# Altium schematic sheet Analog3.schdoc: 916 MHz Transmitter
size B; DocumentNumber: Page Create Date; Revision: 3; SheetNumber: 3; SheetTotal: 3
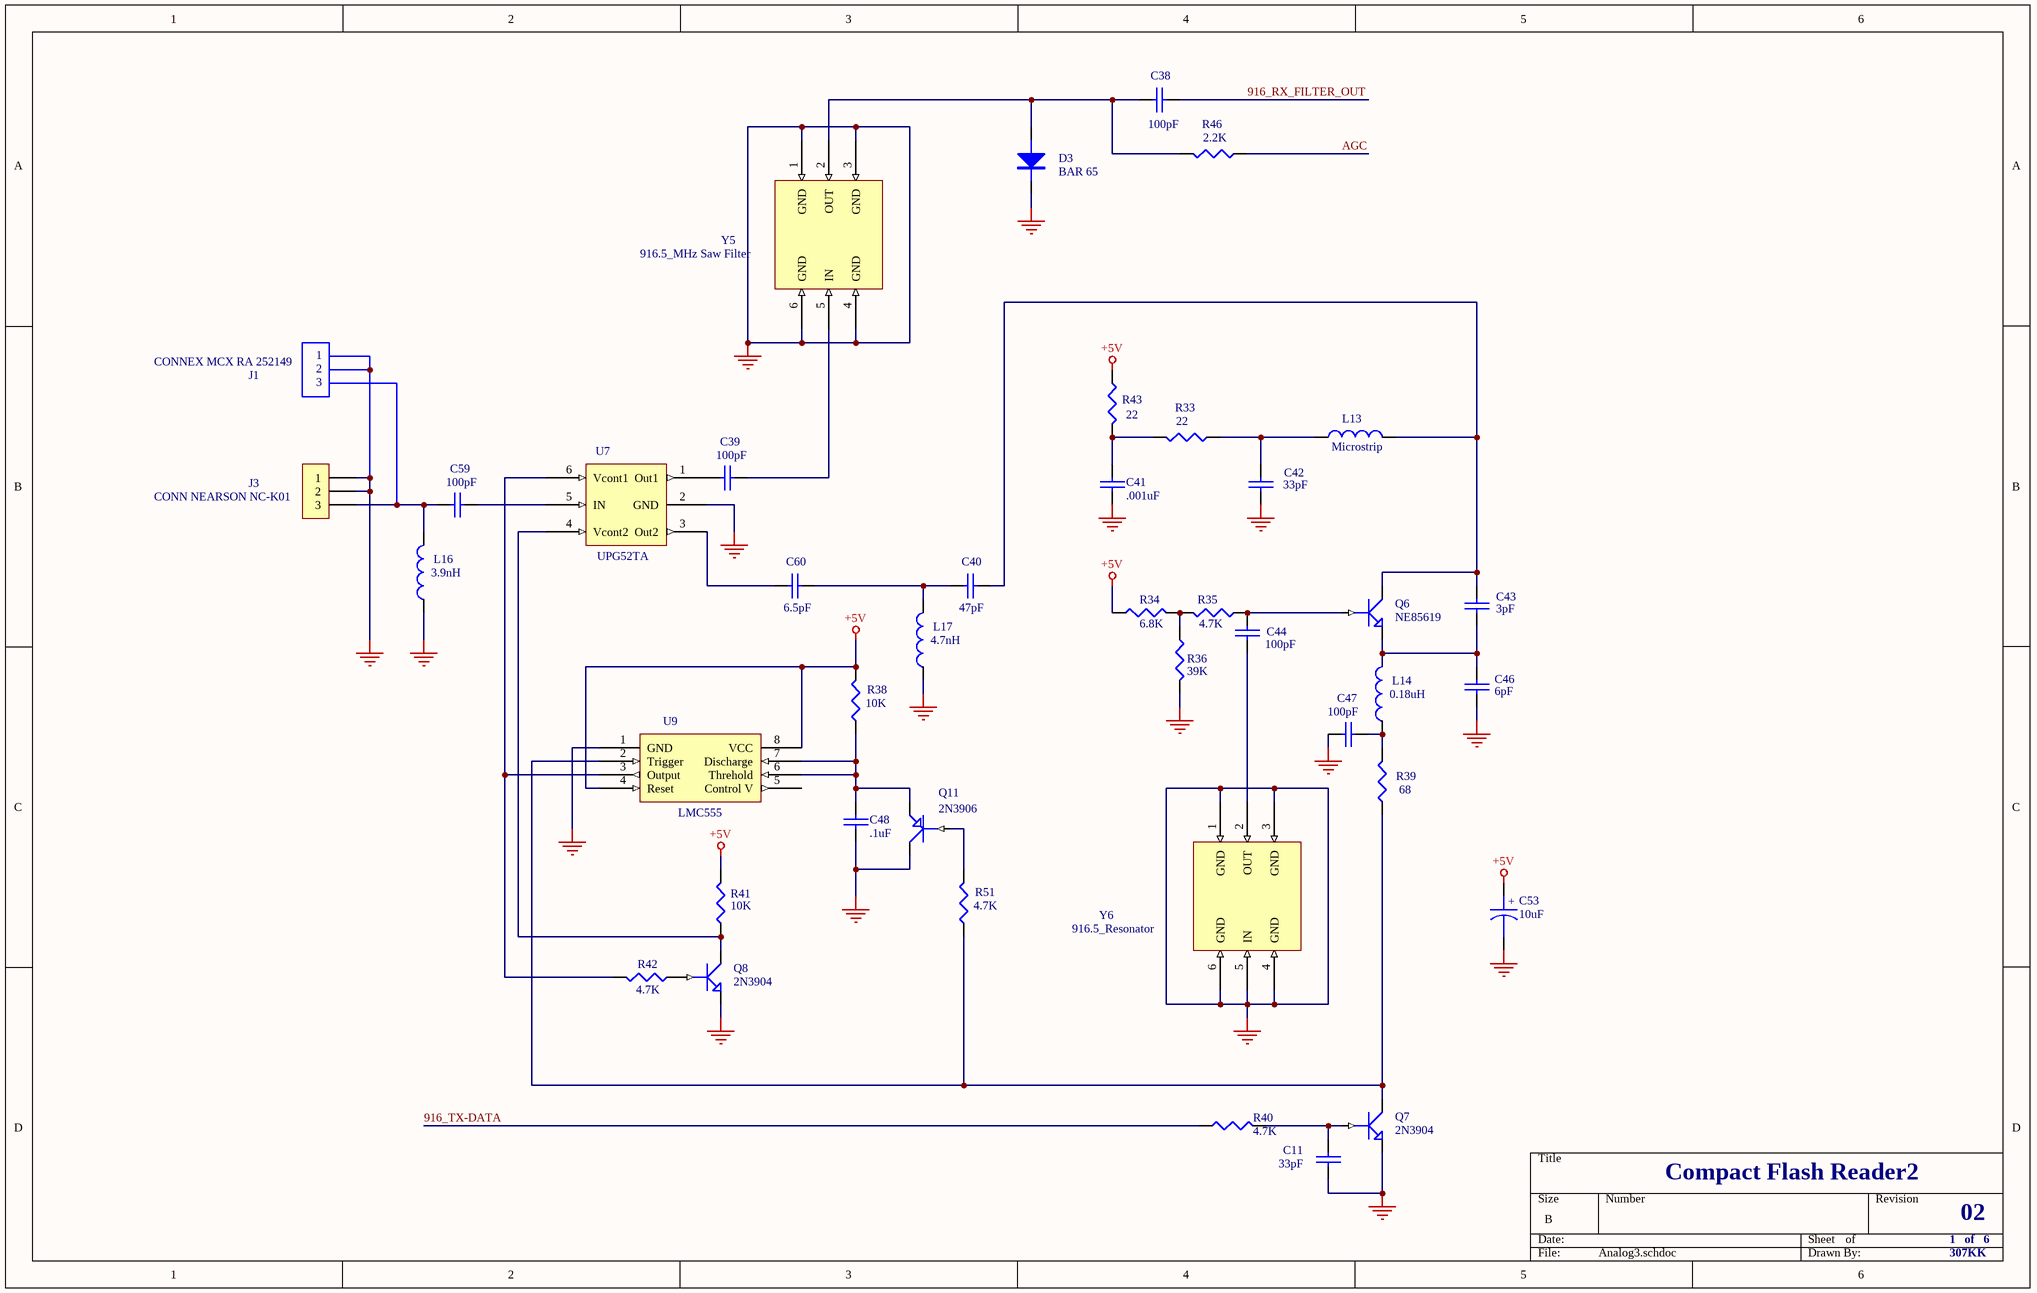
[diagram p0: Analog3.schdoc]

## Parts
C11  33pF  [0603]
C38  100pF  [0603]
C39  100pF  [0603]
C40  47pF  [0603]
C41  .001uF  [0603]
C42  33pF  [0603]
C43  3pF  [0603]
C44  100pF  [0603]
C46  6pF  [0603]
C47  100pF  [0603]
C48  .1uF  [0603]
C53  10uF  [CAP A CASE]
C59  100pF  [0603]
C60  6.5pF  [0603]
D3  BAR 65  [DIODE SC79]
J3  CONN NEARSON NC-K01  [CONN NEARSON NC-K01]
L13  Microstrip  [MICROSTRIP]
L14  0.18uH  [0603]
L16  3.9nH  [0603]
L17  4.7nH  [0603]
Q6  NE85619  [3 PIN ULTRA SUPER MINI MOLD]
Q7  2N3904  [SOT23 TRANS]
Q8  2N3904  [SOT23 TRANS]
Q11  2N3906  [SOT23 TRANS]
R33  22  [0603]
R34  6.8K  [0603]
R35  4.7K  [0603]
R36  39K  [0603]
R38  10K  [0603]
R39  68  [0603]
R40  4.7K  [0603]
R41  10K  [0603]
R42  4.7K  [0603]
R43  22  [0603]
R46  2.2K  [0603]
R51  4.7K  [0603]
U7  UPG52TA  [TO6]
U9  LMC555  [SO8 SMALL]
Y5  916.5_MHz Saw Filter
Y6  916.5_Resonator

## Nets
+5V: C53.1 R34.1 R38.2 R41.2 R43.1 U9.4(Reset) U9.8(VCC)
GND_SIGNAL: C11.2 C41.2 C42.2 C46.2 C47.1 C48.2 C53.2 D3.K J3.1 J3.2 L16.1 L17.1 Q7.E Q8.E Q11.C R36.2 U7.2(GND) U9.1(GND) Y5.1(GND) Y5.3(GND) Y5.4(GND) Y5.6(GND) Y6.1(GND) Y6.3(GND) Y6.4(GND) Y6.5(IN) Y6.6(GND)
916_RX_FILTER_OUT: C38.2
916_TX-DATA: R40.1
AGC: R46.1
NetC11_1: C11.1 Q7.B R40.2
NetC38_1: C38.1 D3.A R46.2 Y5.2(OUT)
NetC39_1: C39.1 U7.1(Out1)
NetC39_2: C39.2 Y5.5(IN)
NetC40_1: C40.1 C60.2 L17.2
NetC40_2: C40.2 C43.1 L13.2 Q6.C
NetC41_1: C41.1 R33.2 R43.2
NetC42_1: C42.1 L13.1 R33.1
NetC43_2: C43.2 C46.1 L14.2 Q6.E
NetC44_1: C44.1 Q6.B R35.1
NetC44_2: C44.2 Y6.2(OUT)
NetC47_2: C47.2 L14.1 R39.2
NetC48_1: C48.1 Q11.E R38.1 U9.6(Threhold) U9.7(Discharge)
NetC59_1: C59.1 J3.3 L16.2
NetC59_2: C59.2 U7.5(IN)
NetC60_1: C60.1 U7.3(Out2)
NetQ7_C: Q7.C R39.1 R51.1 U9.2(Trigger)
NetQ8_B: Q8.B R42.1
NetQ8_C: Q8.C R41.1 U7.4(Vcont2)
NetQ11_B: Q11.B R51.2
NetR34_2: R34.2 R35.2 R36.1
NetR42_2: R42.2 U7.6(Vcont1) U9.3(Output)

Not connected (* = marked no-connect by the designer): U9 5(Control_V)

## Notes on the sheet
- CONNEX MCX RA 252149
- 1
- 2
- J1
- 3
- Compact Flash Reader2
- 1   of   6
- 02
- 307KK
- (in symbol CAPACITOR POL) +

## Library data of the parts
C11 C38-C44 C46-C48 C59 C60 = CAP: Capacitor
C53 = CAPACITOR POL: Capacitor
D3 = DIODE
J3 = CON3: Connector
L13 L14 L16 L17 = INDUCTOR: Text Field1: 20; Text Field2: 40
Q6-Q8 = NPN1: NPN Transistor
Q11 = PNP1: PNP Transistor
R33-R36 R38-R43 R46 R51 = RESISTOR: Text Field1: 20; Text Field2: 30
U7 = UPG152TA_0: Text Field1: 60; Text Field2: 60
U9 = LMC555: Text Field1: 90; Text Field2: 50
Y5 Y6 = RESONATOR3